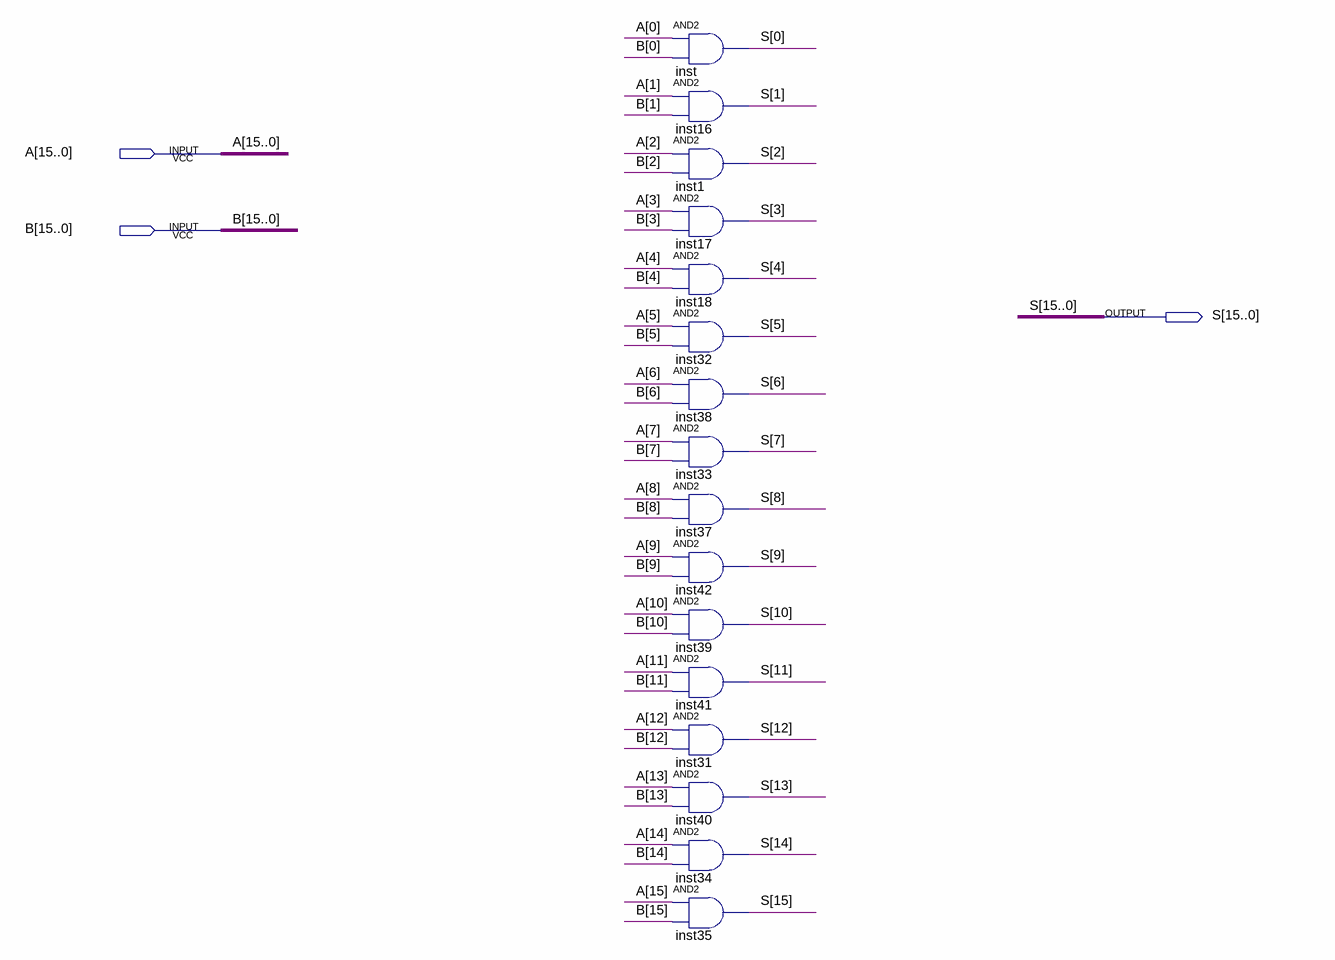
[diagram p0: schematic sheet]
// Quartus schematic AND16bit.bdf as structural Verilog: 16 symbols, 3 pins
module AND16bit (
  input  [15:0] A,
  input  [15:0] B,
  output [15:0] S
);

  and inst (S[0], A[0], B[0]);
  and inst16 (S[1], A[1], B[1]);
  and inst1 (S[2], A[2], B[2]);
  and inst17 (S[3], A[3], B[3]);
  and inst18 (S[4], A[4], B[4]);
  and inst32 (S[5], A[5], B[5]);
  and inst38 (S[6], A[6], B[6]);
  and inst33 (S[7], A[7], B[7]);
  and inst37 (S[8], A[8], B[8]);
  and inst42 (S[9], A[9], B[9]);
  and inst39 (S[10], A[10], B[10]);
  and inst41 (S[11], A[11], B[11]);
  and inst31 (S[12], A[12], B[12]);
  and inst40 (S[13], A[13], B[13]);
  and inst34 (S[14], A[14], B[14]);
  and inst35 (S[15], A[15], B[15]);
endmodule
